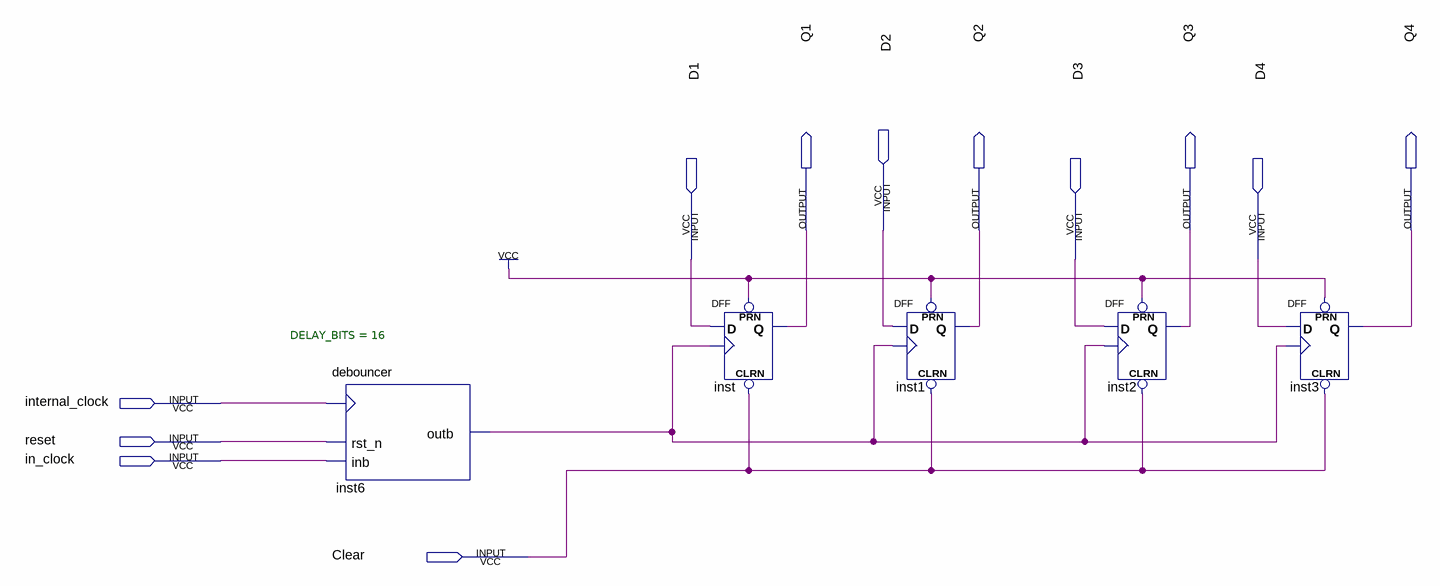
[diagram p0: schematic sheet]
// Quartus schematic Register.bdf as structural Verilog: 5 symbols, 12 pins
module Register (
  input  D2,
  input  D1,
  input  D3,
  input  D4,
  input  internal_clock,
  input  reset,
  input  in_clock,
  input  Clear,
  output Q1,
  output Q2,
  output Q3,
  output Q4
);

  wire inst6_outb;

  debouncer #(.DELAY_BITS(16)) inst6 (.rst_n(reset), .inb(in_clock), .clk(internal_clock), .outb(inst6_outb));
  DFF inst (.CLRN(Clear), .CLK(inst6_outb), .D(D1), .PRN(1'b1), .Q(Q1));
  DFF inst1 (.CLRN(Clear), .CLK(inst6_outb), .D(D2), .PRN(1'b1), .Q(Q2));
  DFF inst2 (.CLRN(Clear), .CLK(inst6_outb), .D(D3), .PRN(1'b1), .Q(Q3));
  DFF inst3 (.CLRN(Clear), .CLK(inst6_outb), .D(D4), .PRN(1'b1), .Q(Q4));
endmodule
